# Altium schematic sheet FPGA_Config.SchDoc: =DocumentName
size A3; DocumentNumber: 1; Revision: 0; SheetNumber: 19; SheetTotal: 20; Last modified by: Krzysztof Belewicz
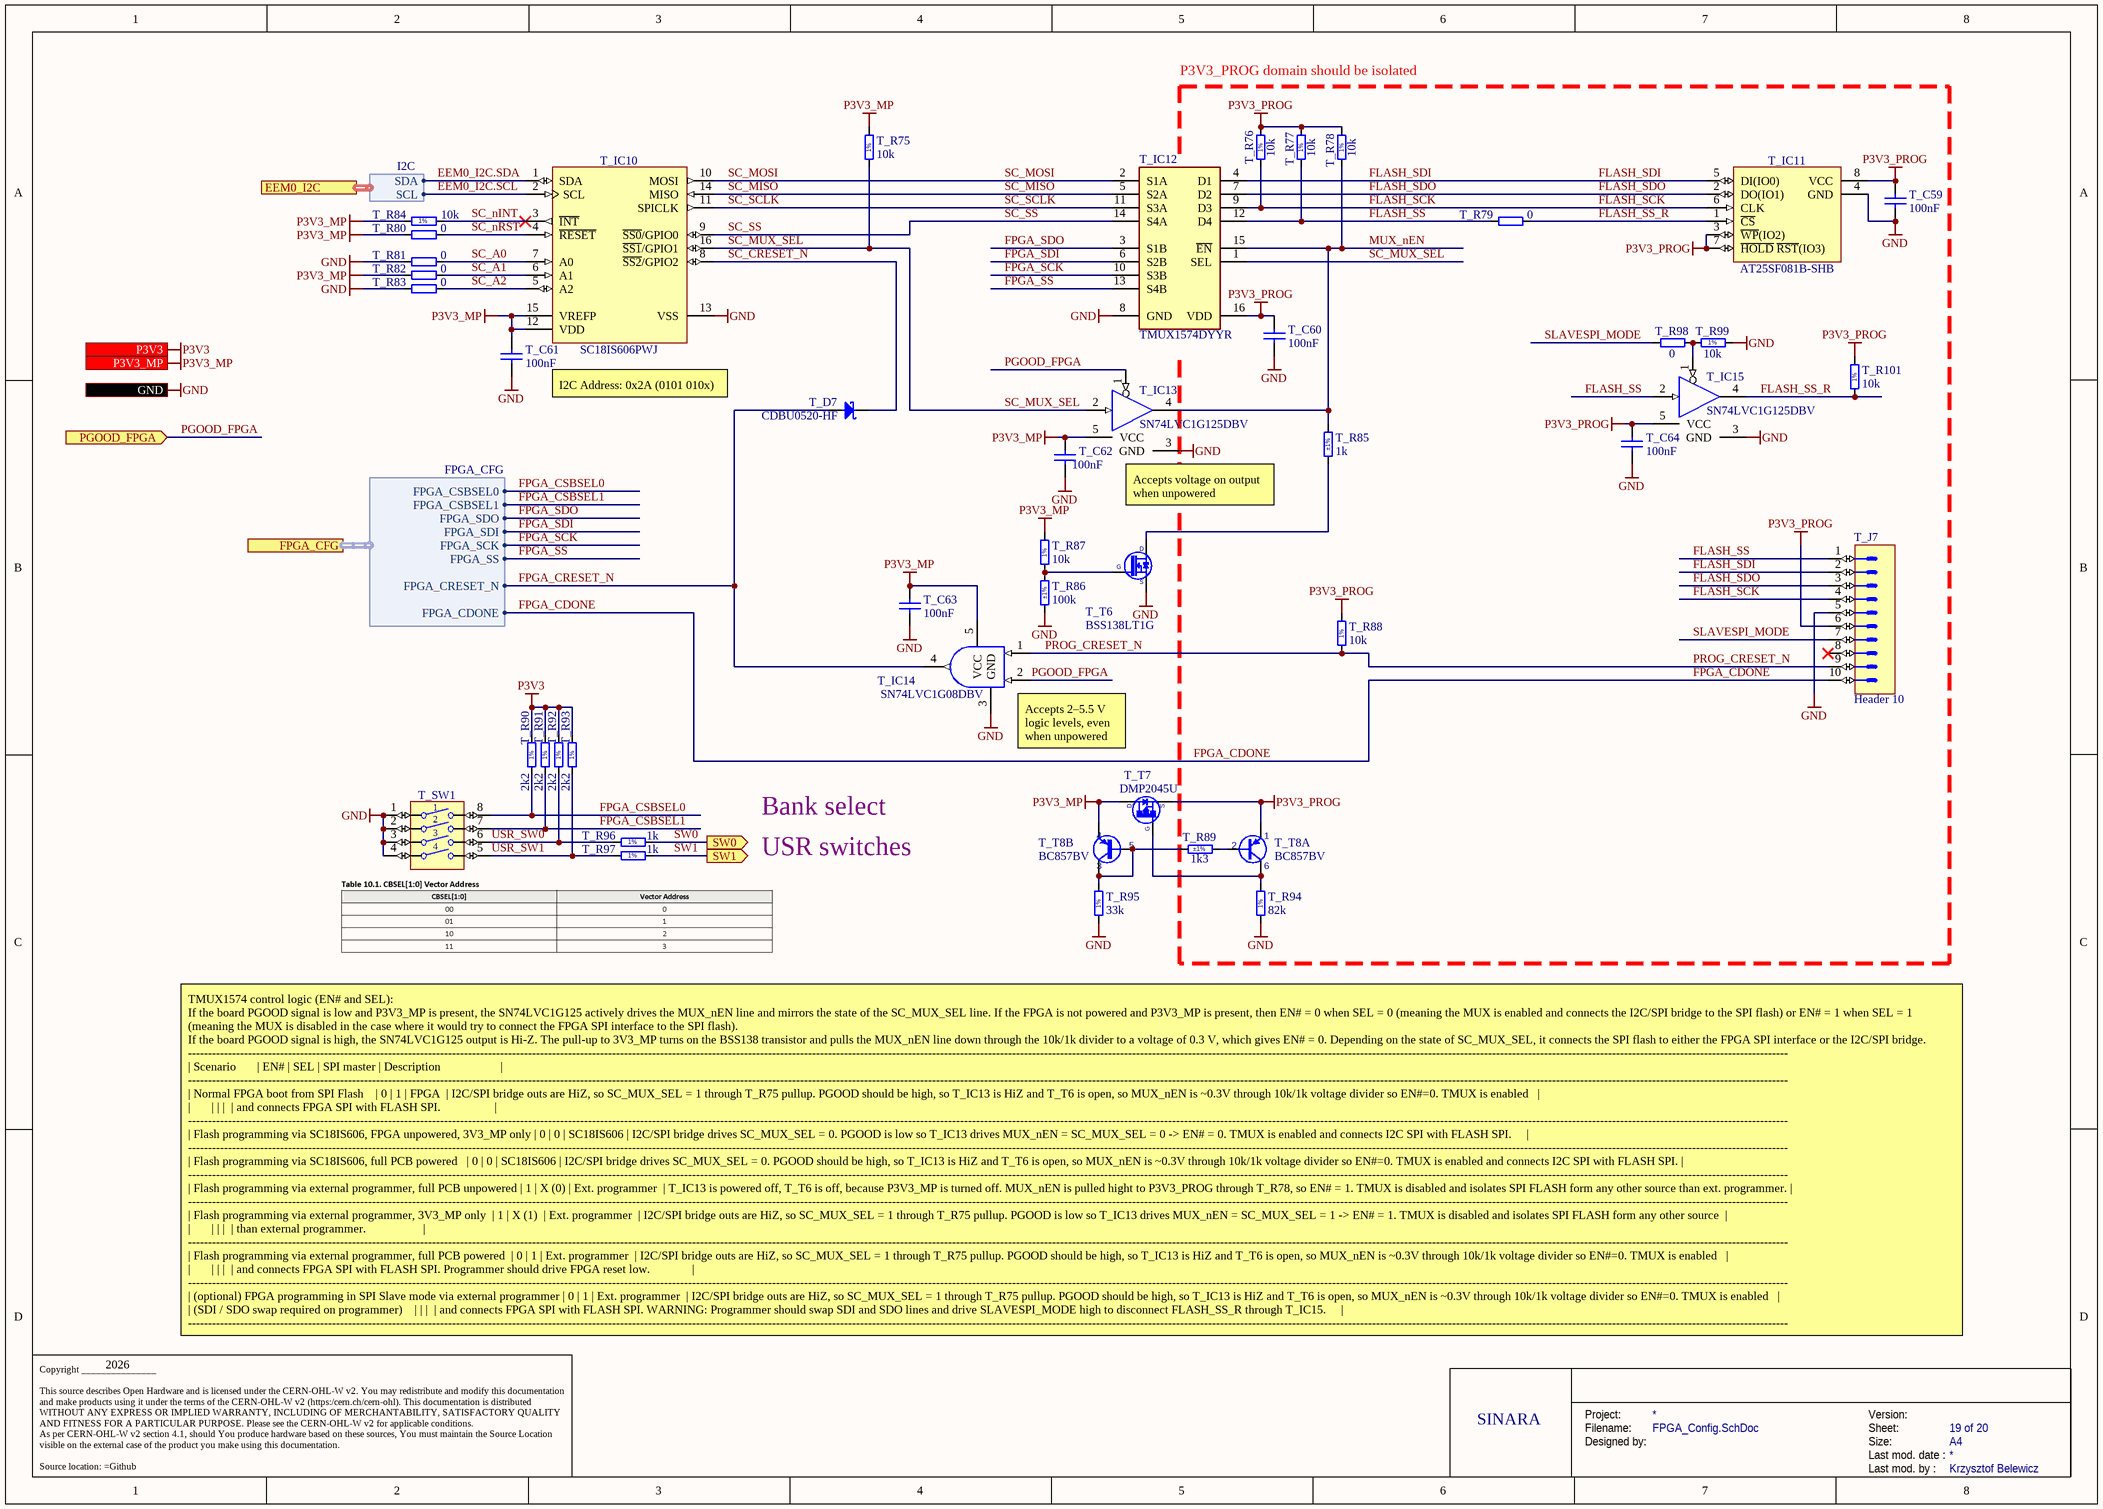
[diagram p0: FPGA_Config.SchDoc]

## Parts
T_C59  100nF  [CAPC1005X55N]
T_C60  100nF  [CAPC1005X55N]
T_C61  100nF  [CAPC1005X55N]
T_C62  100nF  [CAPC1005X55N]
T_C63  100nF  [CAPC1005X55N]
T_C64  100nF  [CAPC1005X55N]
T_D7  CDBU0520-HF  [SOD-523F]
T_IC10  SC18IS606PWJ  [SOP65P640X110-16N]
T_IC11  AT25SF081B-SHB  [SOIC127P790X216-8N]
T_IC12  TMUX1574DYYR  [SOP50P326X110-16N]
T_IC13  SN74LVC1G125DBV  [SOT95P280X145-5N]
T_IC14  SN74LVC1G08DBV  [SOT95P280X145-5N]
T_IC15  SN74LVC1G125DBV  [SOT95P280X145-5N]
T_J7  Header 10  [HARWIN_M20-9980546]
T_R75  10k  [RESC1005X40N]
T_R76  10k  [RESC1005X40N]
T_R77  10k  [RESC1005X40N]
T_R78  10k  [RESC1005X40N]
T_R79  0  [RESC1005X40N]
T_R80  0  [RESC1005X40N]
T_R81  0  [RESC1005X40N]
T_R82  0  [RESC1005X40N]
T_R83  0  [RESC1005X40N]
T_R84  10k  [RESC1005X40N]
T_R85  1k  Tolerance: ±1%  [RESC1005X40N]
T_R86  100k  Tolerance: ±1%  [RESC1005X40N]
T_R87  10k  [RESC1005X40N]
T_R88  10k  [RESC1005X40N]
T_R89  1k3  Tolerance: ±1%  [RESC1005X40N]
T_R90  2k2  [RESC1005X40N]
T_R91  2k2  [RESC1005X40N]
T_R92  2k2  [RESC1005X40N]
T_R93  2k2  [RESC1005X40N]
T_R94  82k  [RESC1608X55N]
T_R95  33k  [RESC1005X40N]
T_R96  1k  [RESC1005X40N]
T_R97  1k  [RESC1005X40N]
T_R98  0  [RESC1005X40N]
T_R99  10k  [RESC1005X40N]
T_R101  10k  [RESC1005X40N]
T_SW1  Switch  [SW_TYCO_1571983-4]  (value not drawn)
T_T6  BSS138LT1G  [SOT95P240X110-3N]
T_T7  DMP2045U  [SOT95P240X110-3N]
T_T8  BC857BV  [SOTFL50P160X60-6N]  (parts A,B of 2)

## Ports
EEM0_I2C (harness I2C), FPGA_CFG (harness FPGA_CFG), GND, P3V3 (in), P3V3_MP (in), PGOOD_FPGA (in), SW0 (out), SW1 (out)

## Harnesses
FPGA_CFG: FPGA_CSBSEL0, FPGA_CSBSEL1, FPGA_SDO, FPGA_SDI, FPGA_SCK, FPGA_SS, FPGA_CRESET_N, FPGA_CDONE
I2C: SDA, SCL

## Nets
GND: T_C59.1 T_C60.1 T_C61.1 T_C62.1 T_C63.1 T_C64.1 T_IC10.13(VSS) T_IC11.4(GND) T_IC12.8(GND) T_IC13.3(GND) T_IC14.3(GND) T_IC15.3(GND) T_J7.5 T_R81.2 T_R83.2 T_R86.2 T_R94.1 T_R95.1 T_R99.2 T_SW1.1 T_SW1.2 T_SW1.3 T_SW1.4 T_T6.2(S) ; port GND
P3V3: T_R90.2 T_R91.2 T_R92.2 T_R93.2 ; port P3V3
P3V3_MP: T_C61.2 T_C62.2 T_C63.2 T_IC10.12(VDD) T_IC10.15(VREFP) T_IC13.5(VCC) T_IC14.5(VCC) T_R75.2 T_R80.2 T_R82.2 T_R84.1 T_R87.2 T_T7.3(D) T_T8.4(E) ; port P3V3_MP
P3V3_PROG: T_C59.2 T_C60.2 T_C64.2 T_IC11.3(~{WP}(IO2)) T_IC11.7(~{HOLD}_~{RST}(IO3)) T_IC11.8(VCC) T_IC12.16(VDD) T_IC15.5(VCC) T_J7.6 T_R76.2 T_R77.2 T_R78.2 T_R88.2 T_R101.2 T_T7.2(S) T_T8.1(E)
EEM0_I2C.SCL: T_IC10.2(SCL) ; port EEM0_I2C.SCL
EEM0_I2C.SDA: T_IC10.1(SDA) ; port EEM0_I2C.SDA
FLASH_SCK: T_IC11.6(CLK) T_IC12.9(D3) T_J7.4 T_R76.1
FLASH_SDI: T_IC11.5(DI(IO0)) T_IC12.4(D1) T_J7.2
FLASH_SDO: T_IC11.2(DO(IO1)) T_IC12.7(D2) T_J7.3
FLASH_SS: T_IC12.12(D4) T_IC15.2(IN) T_J7.1 T_R77.1 T_R79.1
FLASH_SS_R: T_IC11.1(~{CS}) T_IC15.4(OUT) T_R79.2 T_R101.1
FPGA_CDONE: T_J7.10 ; port FPGA_CFG.FPGA_CDONE
FPGA_CRESET_N: T_D7.2(A) T_IC14.4(Y) ; port FPGA_CFG.FPGA_CRESET_N
FPGA_CSBSEL0: T_R90.1 T_SW1.8 ; port FPGA_CFG.FPGA_CSBSEL0
FPGA_CSBSEL1: T_R91.1 T_SW1.7 ; port FPGA_CFG.FPGA_CSBSEL1
FPGA_SCK: T_IC12.10(S3B) ; port FPGA_CFG.FPGA_SCK
FPGA_SDI: T_IC12.6(S2B) ; port FPGA_CFG.FPGA_SDI
FPGA_SDO: T_IC12.3(S1B) ; port FPGA_CFG.FPGA_SDO
FPGA_SS: T_IC12.13(S4B) ; port FPGA_CFG.FPGA_SS
MUX_nEN: T_IC12.15(~{EN}) T_IC13.4(OUT) T_R78.1 T_R85.2
PGOOD_FPGA: T_IC13.1(~{G}) T_IC14.2(B) ; port PGOOD_FPGA
PROG_CRESET_N: T_IC14.1(A) T_J7.9 T_R88.1
SC_A0: T_IC10.7(A0) T_R81.1
SC_A1: T_IC10.6(A1) T_R82.1
SC_A2: T_IC10.5(A2) T_R83.1
SC_CRESET_N: T_D7.1(C) T_IC10.8(~{SS2}/GPIO2)
SC_MISO: T_IC10.14(MISO) T_IC12.5(S2A)
SC_MOSI: T_IC10.10(MOSI) T_IC12.2(S1A)
SC_MUX_SEL: T_IC10.16(~{SS1}/GPIO1) T_IC12.1(SEL) T_IC13.2(IN) T_R75.1
SC_nINT: T_IC10.3(~{INT}) T_R84.2
SC_nRST: T_IC10.4(~{RESET}) T_R80.1
SC_SCLK: T_IC10.11(SPICLK) T_IC12.11(S3A)
SC_SS: T_IC10.9(~{SS0}/GPIO0) T_IC12.14(S4A)
SLAVESPI_MODE: T_J7.7 T_R98.1
SW0: T_R96.1 ; port SW0
SW1: T_R97.1 ; port SW1
USR_SW0: T_R92.1 T_R96.2 T_SW1.6
USR_SW1: T_R93.1 T_R97.2 T_SW1.5
NetT_IC15_1: T_IC15.1(~{G}) T_R98.2 T_R99.1
NetT_R85_1: T_R85.1 T_T6.3(D)
NetT_R86_1: T_R86.1 T_R87.1 T_T6.1(G)
NetT_R89_1: T_R89.1 T_T8.2(B)
NetT_R89_2: T_R89.2 T_R95.2 T_T8.3(C) T_T8.5(B)
NetT_R94_2: T_R94.2 T_T7.1(G) T_T8.6(C)

Not connected (* = marked no-connect by the designer): T_J7 8*

## Notes on the sheet
- P3V3_PROG domain should be isolated
- I2C Address: 0x2A (0101 010x)
- (near T_IC13) Accepts voltage on output when unpowered
- (near T_IC14) Accepts 2–5.5 V logic levels, even when unpowered
- Bank select
- USR switches
- 2026
- TMUX1574 control logic (EN# and SEL):
  If the board PGOOD signal is low and P3V3_MP is present, the SN74LVC1G125 actively drives the MUX_nEN line and mirrors the state of the SC_MUX_SEL line. If the FPGA is not powered and P3V3_MP is present, then EN# = 0 when SEL = 0 (meaning the MUX is enabled and connects the I2C/SPI bridge to the SPI flash) or EN# = 1 when SEL = 1 (meaning the MUX is disabled in the case where it would try to connect the FPGA SPI interface to the SPI flash).
  If the board PGOOD signal is high, the SN74LVC1G125 output is Hi-Z. The pull-up to 3V3_MP turns on the BSS138 transistor and pulls the MUX_nEN line down through the 10k/1k divider to a voltage of 0.3 V, which gives EN# = 0. Depending on the state of SC_MUX_SEL, it connects the SPI flash to either the FPGA SPI interface or the I2C/SPI bridge.
  -------------------------------------------------------------------------------------------------------------------------------------------------------------------------------------------------------------------------------------------------------------------------------------------------------------------------------------------------------------------------------------------------------------------------------------------------
  | Scenario							| EN#	| SEL	| SPI master	| Description																				|
  -------------------------------------------------------------------------------------------------------------------------------------------------------------------------------------------------------------------------------------------------------------------------------------------------------------------------------------------------------------------------------------------------------------------------------------------------
  | Normal FPGA boot from SPI Flash				| 0	| 1	| FPGA		| I2C/SPI bridge outs are HiZ, so SC_MUX_SEL = 1 through T_R75 pullup. PGOOD should be high, so T_IC13 is HiZ and T_T6 is open, so MUX_nEN is ~0.3V through 10k/1k voltage divider so EN#=0. TMUX is enabled 		|
  |							|	|	|		| and connects FPGA SPI with FLASH SPI.																		|
  -------------------------------------------------------------------------------------------------------------------------------------------------------------------------------------------------------------------------------------------------------------------------------------------------------------------------------------------------------------------------------------------------------------------------------------------------
  | Flash programming via SC18IS606, FPGA unpowered, 3V3_MP only	| 0	| 0	| SC18IS606	| I2C/SPI bridge drives SC_MUX_SEL = 0. PGOOD is low so T_IC13 drives MUX_nEN = SC_MUX_SEL = 0 -> EN# = 0. TMUX is enabled and connects I2C SPI with FLASH SPI.					|
  -------------------------------------------------------------------------------------------------------------------------------------------------------------------------------------------------------------------------------------------------------------------------------------------------------------------------------------------------------------------------------------------------------------------------------------------------
  | Flash programming via SC18IS606, full PCB powered			| 0	| 0	| SC18IS606	| I2C/SPI bridge drives SC_MUX_SEL = 0. PGOOD should be high, so T_IC13 is HiZ and T_T6 is open, so MUX_nEN is ~0.3V through 10k/1k voltage divider so EN#=0. TMUX is enabled and connects I2C SPI with FLASH SPI.	|
  -------------------------------------------------------------------------------------------------------------------------------------------------------------------------------------------------------------------------------------------------------------------------------------------------------------------------------------------------------------------------------------------------------------------------------------------------
  | Flash programming via external programmer, full PCB unpowered	| 1	| X (0)	| Ext. programmer 	| T_IC13 is powered off, T_T6 is off, because P3V3_MP is turned off. MUX_nEN is pulled hight to P3V3_PROG through T_R78, so EN# = 1. TMUX is disabled and isolates SPI FLASH form any other source than ext. programmer.	|
  -------------------------------------------------------------------------------------------------------------------------------------------------------------------------------------------------------------------------------------------------------------------------------------------------------------------------------------------------------------------------------------------------------------------------------------------------
  | Flash programming via external programmer, 3V3_MP only		| 1	| X (1) 	| Ext. programmer 	| I2C/SPI bridge outs are HiZ, so SC_MUX_SEL = 1 through T_R75 pullup. PGOOD is low so T_IC13 drives MUX_nEN = SC_MUX_SEL = 1 -> EN# = 1. TMUX is disabled and isolates SPI FLASH form any other source		|
  |							|	|	|		| than external programmer.																			|
  -------------------------------------------------------------------------------------------------------------------------------------------------------------------------------------------------------------------------------------------------------------------------------------------------------------------------------------------------------------------------------------------------------------------------------------------------
  | Flash programming via external programmer, full PCB powered		| 0	| 1	| Ext. programmer 	| I2C/SPI bridge outs are HiZ, so SC_MUX_SEL = 1 through T_R75 pullup. PGOOD should be high, so T_IC13 is HiZ and T_T6 is open, so MUX_nEN is ~0.3V through 10k/1k voltage divider so EN#=0. TMUX is enabled 		|
  |							|	|	|		| and connects FPGA SPI with FLASH SPI. Programmer should drive FPGA reset low.														|
  -------------------------------------------------------------------------------------------------------------------------------------------------------------------------------------------------------------------------------------------------------------------------------------------------------------------------------------------------------------------------------------------------------------------------------------------------
  | (optional) FPGA programming in SPI Slave mode via external programmer	| 0	| 1	| Ext. programmer 	| I2C/SPI bridge outs are HiZ, so SC_MUX_SEL = 1 through T_R75 pullup. PGOOD should be high, so T_IC13 is HiZ and T_T6 is open, so MUX_nEN is ~0.3V through 10k/1k voltage divider so EN#=0. TMUX is enabled 		|
  | (SDI / SDO swap required on programmer)				|	|	|		| and connects FPGA SPI with FLASH SPI. WARNING: Programmer should swap SDI and SDO lines and drive SLAVESPI_MODE high to disconnect FLASH_SS_R through T_IC15.					|
  -------------------------------------------------------------------------------------------------------------------------------------------------------------------------------------------------------------------------------------------------------------------------------------------------------------------------------------------------------------------------------------------------------------------------------------------------
- SINARA
- Project:
- Designed by:
- Filename:
- Size:
- Version:
- Last mod. date :
- Sheet:
- A4
- Copyright _______________
  This source describes Open Hardware and is licensed under the CERN-OHL-W v2. You may redistribute and modify this documentation and make products using it under the terms of the CERN-OHL-W v2 (https:/cern.ch/cern-ohl). This documentation is distributed WITHOUT ANY EXPRESS OR IMPLIED WARRANTY, INCLUDING OF MERCHANTABILITY, SATISFACTORY QUALITY AND FITNESS FOR A PARTICULAR PURPOSE. Please see the CERN-OHL-W v2 for applicable conditions.
  As per CERN-OHL-W v2 section 4.1, should You produce hardware based on these sources, You must maintain the Source Location visible on the external case of the product you make using this documentation.
  Source location: =Github
- Last mod. by :
- (in symbol R0402_1K_1%_0.0625W_100PPM) 1%
- (in symbol R0402_2K2_1%_0.0625W_100PPM) 1%
- (in symbol R0402_10K_1%_0.0625W_100PPM) 1%
- (in symbol R0402_33K_1%_0.0625W_100PPM) 1%
- (in symbol R0603_82K_1%_0.1W_100PPM) 1%

## Library data of the parts
T_C59-T_C64 = CC0402_100NF_16V_10%_X5R: Non-polarised capacitor; Part Description: SMD Multilayer Chip Ceramic Capacitor; Manufacturer: GENERIC; Manufacturer1 Part Number: GRM155R61C104KA88D; Voltage: 16V; TC: X5R; Tolerance: ±10%; Part Number: CC0402_100NF_16V_10%_X5R; Component Kind: Standard; Component Type: Standard; Pin Count: 2; Value: 100nF; Status: None; Manufacturer Part Number: CC0402_100NF_16V_10%_X5R; Case: 0402; Mounted: Yes; Socket: No; SMD: Yes; Sense: No; Manufacturer1 Example: MURATA; Manufacturer1 ComponentHeight: 0.55mm; HelpURL: \\cern.ch\dfs\Applications\Altium\Datasheets\CC0402_X5R_MURATA_GRM.pdf; Author: CERN DEM JLC; CreateDate: 10.12.2013; LatestRevisionDate: 10.12.2013
T_D7 = CDBU0520-HF: Schottky Diode; Part Description: 20V Surface mount Schottky Barrier Diode; Manufacturer: COMCHIP; Voltage: 20V; Power: 500mA; PressFit: No; Bonding: No; Part Number: CDBU0520-HF; Component Kind: Standard; Component Type: Standard; Device: CDBU0520-HF; PackageDescription: Small Outline Diode Flat Lead (SOD-523F), Body; 1.80mm L X 1mm W X 0.85mm H; Manufacturer Part Number: CDBU0520-HF; Pin Count: 2; Case: SOD-523F; Mounted: Yes; Socket: No; SMD: Yes; Sense: No; ComponentHeight: 1mm; HelpURL: \\cern.ch\dfs\Applications\Altium\Datasheets\CDBU0520-HF.pdf; Author: CERN DEM HF; CreateDate: 13.10.2023; LatestRevisionDate: 13.10.2023
T_IC10 = SC18IS606PWJ: I2C-bus to SPI bridge; Manufacturer: NXP SEMICONDUCTORS; PressFit: No; Bonding: No; Part Number: SC18IS606PWJ; Component Kind: Standard; Component Type: Standard; Device: SC18IS606PWJ; PackageDescription: SOP, 0.65mm pitch; 16 pin, 4.40mm W X 5.00mm L X 1.10mm H body IPC Medium Density; Part Description: I2C-Bus to SPI Bridge; Manufacturer Part Number: SC18IS606PWJ; Pin Count: 16; Case: TSSOP16; Mounted: Yes; Socket: No; SMD: Yes; Sense: No; ComponentHeight: 1.1mm; HelpURL: \\cern.ch\dfs\Applications\Altium\Datasheets\SC18IS602B.pdf; Author: GK; CreateDate: 14/12/2015; LatestRevisionDate: 14/12/2015
T_IC11 = MEM_AT25SF081B-SHB: 8M-bit Serial Flash Memory with uniform 4KB sectors and Dual/Quad SPI and QPI; Manufacturer: Renesas; PressFit: No; Bonding: No; Part Number: AT25SF081B-SHB; Component Kind: Standard; Component Type: Standard; Device: AT25SF081B-SHB; PackageDescription: SOIC, 1.27mm Pitch; 8 Pin, 5.285mm W X 5.335mm L X 2.16mm H body, IPC Medium Density; Part Description: 8M-bit Serial Flash Memory with uniform 4KB sectors and Dual/Quad SPI and QPI; Manufacturer Part Number: AT25SF081B-SHB; Pin Count: 8; Case: SOIC8; Mounted: Yes; Socket: No; SMD: Yes; Sense: No; ComponentHeight: 2.16mm; HelpURL: \\cern.ch\dfs\Applications\Altium\Datasheets\W25Q128FVSIG.pdf; Author: GK; CreateDate: 26/01/2018; LatestRevisionDate: 26/01/2018
T_IC12 = TMUX1574DYYR: Integrated Circuit; Manufacturer_Name: Texas Instruments; Datasheet Link: https://www.ti.com/lit/gpn/TMUX1574; Height: 1.1mm; Manufacturer_Part_Number: TMUX1574DYYR; Mouser Part Number: 595-TMUX1574DYYR; Mouser Price/Stock: https://www.mouser.co.uk/ProductDetail/Texas-Instruments/TMUX1574DYYR?qs=B6kkDfuK7%2FDgs0e8M6dtlw%3D%3D; Arrow Part Number: TMUX1574DYYR; Arrow Price/Stock: https://www.arrow.com/en/products/tmux1574dyyr/texas-instruments.html?utm_currency=USD&region=nac
T_IC13 T_IC15 = SN74LVC1G125DBV: Single Bus Buffer Gate With 3-State Output; Part Description: Single Bus Buffer Gate with 3-State Outputs; Manufacturer: TEXAS INSTRUMENTS; PressFit: No; Bonding: No; Part Number: SN74LVC1G125DBV; Component Kind: Standard; Component Type: Standard; Device: SN74LVC1G125DBV; PackageDescription: SOT, 0.95mm Pitch; 5 Pin, 1.60mm W X 2.90mm L X 1.45mm H body, IPC Medium Density; Manufacturer Part Number: SN74LVC1G125DBV; Pin Count: 5; Case: SOT23-5; Mounted: Yes; Socket: No; SMD: Yes; Sense: No; ComponentHeight: 1.45mm; Author: CERN DEM HF; HelpURL: \\cern.ch\dfs\Applications\Altium\Datasheets\SN74LVC1G125.pdf; CreateDate: 15.11.2022; LatestRevisionDate: 15.11.2022
T_IC14 = SN74LVC1G08DBV: Single 2-Input AND Gate; Part Description: Single 2-Input Positive-AND Gate; Manufacturer: TEXAS INSTRUMENTS; PressFit: No; Bonding: No; Part Number: SN74LVC1G08DBV; Component Kind: Standard; Component Type: Standard; Device: SN74LVC1G08DBV; PackageDescription: SOT, 0.95mm Pitch; 5 Pin, 1.60mm W X 2.90mm L X 1.45mm H body, IPC Medium Density; Manufacturer Part Number: SN74LVC1G08DBV; Pin Count: 5; Case: SOT23-5; Mounted: Yes; Socket: No; SMD: Yes; Sense: No; ComponentHeight: 1.45mm; Author: CERN DEM JLC; HelpURL: \\cern.ch\dfs\Applications\Altium\Datasheets\SN74LVC1G08.pdf; CreateDate: 28.08.2012; LatestRevisionDate: 27.10.2021
T_J7 = HARWIN_M20-9980546: Connector 10 Male; Part Description: 10 Contacts - Pitch 2.54mm - Dual Row Straight Header (Lead Length 6.1mm, Insulator 2.54mm); Manufacturer: HARWIN; PressFit: No; Part Number: HARWIN_M20-9980546; Component Kind: Standard; Component Type: Standard; Pin Count: 10; Family: Header 10; Mounted: Yes; Socket: No; SMD: No; Sense: No; Status: None; Manufacturer Part Number: M20-9980546; ComponentHeight: 8.64mm; HelpURL: \\cern.ch\dfs\Applications\Altium\Datasheets\HARWIN_M20-9980546.pdf; Author: CERN DEM MR; CreateDate: 9/15/2017; LatestRevisionDate: 9/15/2017
T_R75-T_R78 T_R84 T_R87 T_R88 T_R99 T_R101 = R0402_10K_1%_0.0625W_100PPM: Resistor - 1%; Part Description: General Purpose Thick Film Chip Resistor; Manufacturer: GENERIC; Manufacturer1 Part Number: 232270671003L; TC: ±100ppm/°C; Table: Resistors SMD; Part Number: R0402_10K_1%_0.0625W_100PPM; Component Kind: Standard; Component Type: Standard; Pin Count: 2; Value: 10k; Status: Not recommended; Power: 0.0625W; Tolerance: ±1%; Manufacturer Part Number: R0402_10K_1%_0.0625W_100PPM; Case: 0402; Mounted: Yes; Socket: No; SMD: Yes; Manufacturer1 Example: YAGEO PHYCOMP; Manufacturer1 ComponentHeight: 0.4mm; HelpURL: \\cern.ch\dfs\Applications\Altium\Datasheets\R0402_Phycomp_RC0402.pdf; Author: CERN DEM JLC; CreateDate: 2007-12-03; LatestRevisionDate: 2012-10-17
T_R79-T_R83 T_R98 = R0402_0R_JUMPER: Resistor; Part Description: 1A (0.05R Max DC Resistance) Zero Ohm Jumper; Manufacturer: GENERIC; Manufacturer1 Part Number: 232270591001L; PressFit: No; Part Number: R0402_0R_JUMPER; Component Kind: Standard; Component Type: Standard; Pin Count: 2; Value: 0; Status: Not Recommended; Manufacturer Part Number: R0402_0R_JUMPER; Case: 0402; Mounted: Yes; Sense: No; Socket: No; SMD: Yes; Manufacturer1 Example: YAGEO PHYCOMP; Manufacturer1 ComponentHeight: 0.4mm; HelpURL: \\cern.ch\dfs\Applications\Altium\Datasheets\R0402_Phycomp_RC0402.pdf; Author: CERN DEM JLC; CreateDate: 03.12.2007; LatestRevisionDate: 17.10.2012
T_R85 T_R96 T_R97 = R0402_1K_1%_0.0625W_100PPM: Resistor - 1%; Part Description: General Purpose Thick Film Chip Resistor; Manufacturer: GENERIC; Manufacturer1 Part Number: 232270671002L; TC: ±100ppm/°C; PressFit: No; Part Number: R0402_1K_1%_0.0625W_100PPM; Component Kind: Standard; Component Type: Standard; Pin Count: 2; Value: 1k; Status: Not Recommended; Power: 0.0625W; Manufacturer Part Number: R0402_1K_1%_0.0625W_100PPM; Case: 0402; Mounted: Yes; Sense: No; Socket: No; SMD: Yes; Manufacturer1 Example: YAGEO PHYCOMP; Manufacturer1 ComponentHeight: 0.4mm; HelpURL: \\cern.ch\dfs\Applications\Altium\Datasheets\R0402_Phycomp_RC0402.pdf; Author: CERN DEM JLC; CreateDate: 03.12.2007; LatestRevisionDate: 17.10.2012
  T_R96 T_R97: Tolerance: ±1%
T_R86 = R0402_100K_1%_0.0625W_100PPM: Resistor - 1%; Part Description: General Purpose Thick Film Chip Resistor; Manufacturer: GENERIC; Manufacturer1 Part Number: 232270671004L; TC: ±100ppm/°C; PressFit: No; Part Number: R0402_100K_1%_0.0625W_100PPM; Component Kind: Standard; Component Type: Standard; Pin Count: 2; Value: 100k; Status: Not Recommended; Power: 0.0625W; Manufacturer Part Number: R0402_100K_1%_0.0625W_100PPM; Case: 0402; Mounted: Yes; Sense: No; Socket: No; SMD: Yes; Manufacturer1 Example: YAGEO PHYCOMP; Manufacturer1 ComponentHeight: 0.4mm; HelpURL: \\cern.ch\dfs\Applications\Altium\Datasheets\R0402_Phycomp_RC0402.pdf; Author: CERN DEM JLC; CreateDate: 03.12.2007; LatestRevisionDate: 17.10.2012
T_R89 = R0402_1K3_1%_0.0625W_100PPM: Resistor - 1%; Part Description: General Purpose Thick Film Chip Resistor; Manufacturer: GENERIC; Manufacturer1 Part Number: 232270671302L; TC: ±100ppm/°C; PressFit: No; Part Number: R0402_1K3_1%_0.0625W_100PPM; Component Kind: Standard; Component Type: Standard; Pin Count: 2; Value: 1k3; Status: Not Recommended; Power: 0.0625W; Manufacturer Part Number: R0402_1K3_1%_0.0625W_100PPM; Case: 0402; Mounted: Yes; Sense: No; Socket: No; SMD: Yes; Manufacturer1 Example: YAGEO PHYCOMP; Manufacturer1 ComponentHeight: 0.4mm; HelpURL: \\cern.ch\dfs\Applications\Altium\Datasheets\R0402_Phycomp_RC0402.pdf; Author: CERN DEM JLC; CreateDate: 03.12.2007; LatestRevisionDate: 17.10.2012
T_R90-T_R93 = R0402_2K2_1%_0.0625W_100PPM: Resistor - 1%; Part Description: General Purpose Thick Film Chip Resistor; Manufacturer: GENERIC; Manufacturer1 Part Number: 232270672202L; TC: ±100ppm/°C; Table: Resistors SMD; Part Number: R0402_2K2_1%_0.0625W_100PPM; Component Kind: Standard; Component Type: Standard; Pin Count: 2; Value: 2k2; Status: Not recommended; Power: 0.0625W; Tolerance: ±1%; Manufacturer Part Number: R0402_2K2_1%_0.0625W_100PPM; Case: 0402; Mounted: Yes; Socket: No; SMD: Yes; Manufacturer1 Example: YAGEO PHYCOMP; Manufacturer1 ComponentHeight: 0.4mm; HelpURL: \\cern.ch\dfs\Applications\Altium\Datasheets\R0402_Phycomp_RC0402.pdf; Author: CERN DEM JLC; CreateDate: 2007-12-03; LatestRevisionDate: 2012-10-17
T_R94 = R0603_82K_1%_0.1W_100PPM: Resistor - 1%; Part Description: General Purpose Thick Film Chip Resistor; Manufacturer: GENERIC; Manufacturer1 Part Number: NRC06F8202TRF; Power: 0.1W; TC: ±100ppm/°C; Part Number: R0603_82K_1%_0.1W_100PPM; Component Kind: Standard; Component Type: Standard; Pin Count: 2; Value: 82k; Status: Preferred; Tolerance: ±1%; Manufacturer Part Number: R0603_82K_1%_0.1W_100PPM; Case: 0603; Mounted: Yes; Sense: No; Socket: No; SMD: Yes; Manufacturer1 Example: NIC COMPONENT; Manufacturer1 ComponentHeight: 0.55mm; HelpURL: \\cern.ch\dfs\Applications\Altium\Datasheets\R0603_NIC_NRC.pdf; Author: CERN DEM JLC; CreateDate: 03.12.2007; LatestRevisionDate: 13.03.2008
T_R95 = R0402_33K_1%_0.0625W_100PPM: Resistor - 1%; Part Description: General Purpose Thick Film Chip Resistor; Manufacturer: GENERIC; Manufacturer1 Part Number: 232270673303L; TC: ±100ppm/°C; PressFit: No; Part Number: R0402_33K_1%_0.0625W_100PPM; Component Kind: Standard; Component Type: Standard; Pin Count: 2; Value: 33k; Status: Not Recommended; Power: 0.0625W; Tolerance: ±1%; Manufacturer Part Number: R0402_33K_1%_0.0625W_100PPM; Case: 0402; Mounted: Yes; Sense: No; Socket: No; SMD: Yes; Manufacturer1 Example: YAGEO PHYCOMP; Manufacturer1 ComponentHeight: 0.4mm; HelpURL: \\cern.ch\dfs\Applications\Altium\Datasheets\R0402_Phycomp_RC0402.pdf; Author: CERN DEM JLC; CreateDate: 03.12.2007; LatestRevisionDate: 17.10.2012
T_SW1 = SW_TYCO_1571983-4: 4 Ways SPST DIP Switch; Part Description: 4 Way SPST SMD DIP Switch, Latched, Contact Rating 0.025A 24VDC; Manufacturer: TYCO; Manufacturer Part Number: 1571983-4 or GDH04S04; PressFit: No; Part Number: SW_TYCO_1571983-4; Component Kind: Standard; Component Type: Standard; Pin Count: 8; PackageDescription: Pitch 1.27mm,  Body 6.2x6.2mm, 4 Ways SPST Surface-Mount DIP Switch, TYCO GDH Series; Family: Switch; Mounted: Yes; Socket: No; SMD: Yes; Sense: No; Status: None; ComponentHeight: 2.31mm; HelpURL: \\cern.ch\dfs\Applications\Altium\Datasheets\SW_TYCO_1571983-4.pdf; Author: CERN DEM JLC; CreateDate: 08/01/2009; LatestRevisionDate: 08/01/2009
T_T6 = BSS138LT1G: N-CHANNEL MOSFET WITH DIODE; Part Description: 50V, 200mA N-Channel Enhancement Mode Field-Effect Transistor; Manufacturer: ON SEMICONDUCTOR; PressFit: No; Bonding: No; Part Number: BSS138LT1G; Component Kind: Standard; Component Type: Standard; Device: BSS138LT1G; PackageDescription: SOT23, 0.95mm Pitch; 3 Pin, 1.40mm W X 3.00mm L X 1.10mm H body, IPC Medium Density; Manufacturer Part Number: BSS138L; Pin Count: 3; Case: SOT23-3; Mounted: Yes; Socket: No; SMD: Yes; Sense: No; ComponentHeight: 1.11mm; HelpURL: \\cern.ch\dfs\Applications\Altium\Datasheets\BSS138LT1G.pdf; Author: CERN DEM JLC; CreateDate: 23.03.2009; LatestRevisionDate: 25.05.2022
T_T7 = DMP2045U: P-CHANNEL MOSFET WITH DIODE; Part Description: 20V, 4.3A, P-Channel Enhancement Mode MOSFET; Manufacturer: DIODES INCORPORATED; PressFit: No; Bonding: No; Part Number: DMP2045U; Component Kind: Standard; Component Type: Standard; Device: DMP2045U; PackageDescription: SOT23, 0.95mm Pitch; 3 Pin, 1.40mm W X 3.00mm L X 1.10mm H body, IPC Medium Density; Manufacturer Part Number: DMP2045U; Pin Count: 3; Case: SOT23-3; Mounted: Yes; Socket: No; SMD: Yes; Sense: No; ComponentHeight: 1.4mm; HelpURL: \\cern.ch\dfs\Applications\Altium\Datasheets\DMP2045U.pdf; Author: CERN DEM HF; CreateDate: 24.09.2025; LatestRevisionDate: 24.09.2025
T_T8 = BC857BV: 45V, 100mA PNP General Purpose Double Transistor; Part Description: -45V -100mA PNP General Purpose Double Transistor; Manufacturer: NXP SEMICONDUCTORS; PressFit: No; Bonding: No; Part Number: BC857BV; Component Kind: Standard; Component Type: Standard; Device: BC857BV; PackageDescription: SOTFL (SOT666), 0.50mm, Pitch; 6 Pin, 1.20mm W X 1.60mm L X 0.60mm H Body, IPC Medium Density; Manufacturer Part Number: BC857BV; Pin Count: 6; Case: SOT666; Mounted: Yes; Socket: No; SMD: Yes; Sense: No; ComponentHeight: 0.6mm; HelpURL: \\cern.ch\dfs\Applications\Altium\Datasheets\BC857BV.pdf; Author: CERN DEM JLC; CreateDate: 01/12/2011; LatestRevisionDate: 01/12/2011